# Altium schematic sheet windsensor.SchDoc
size A
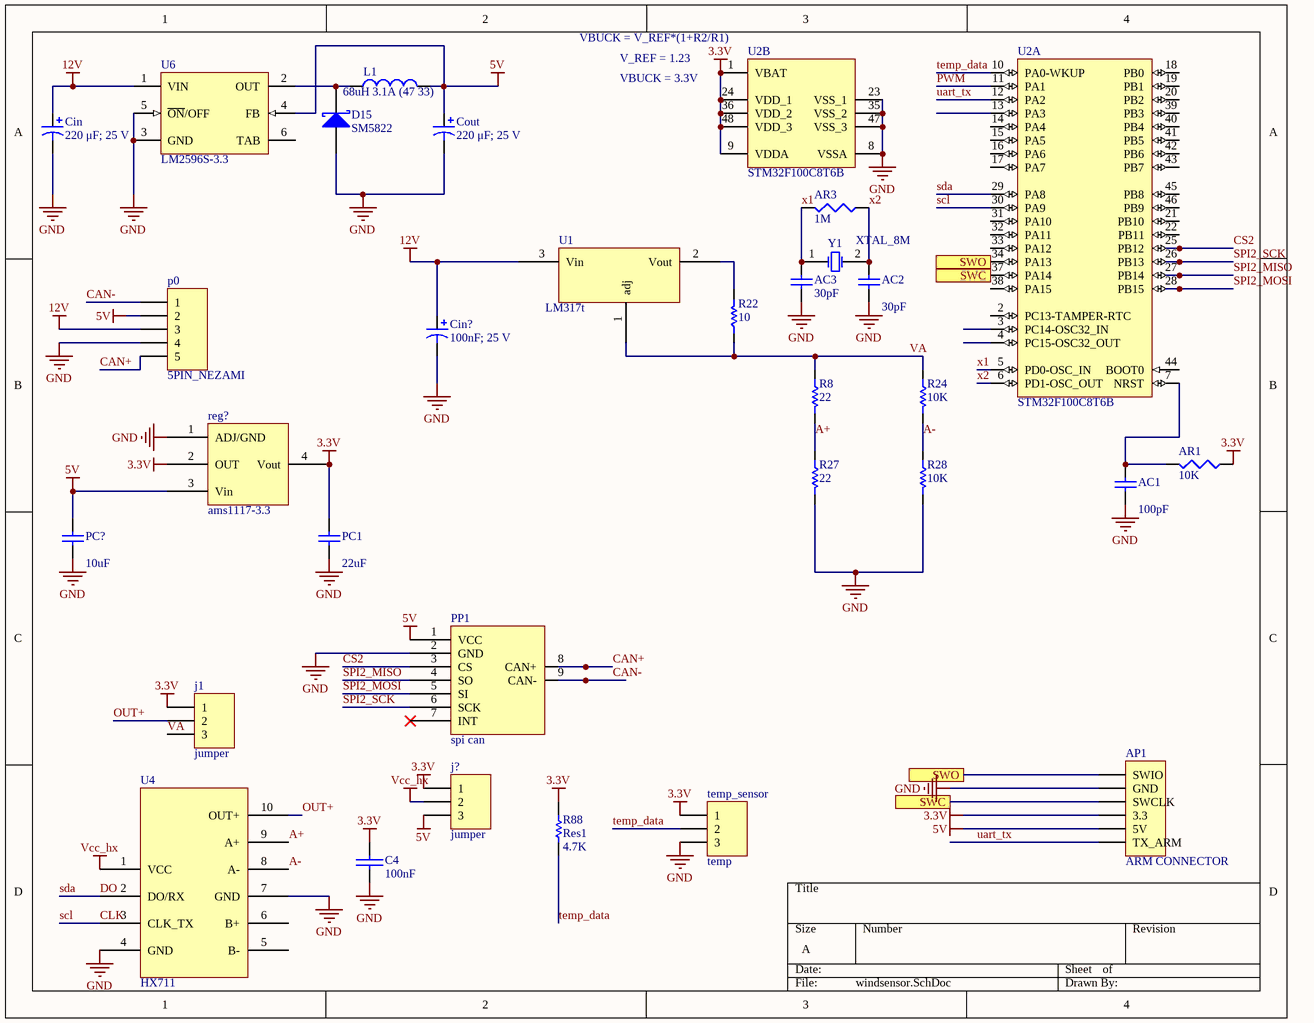
[diagram p0: windsensor.SchDoc]

## Parts
AC1  value 100pF  [1608[0603]]  (hidden comment: Cap Semi)
AC2  value 30pF  [C1206]  (hidden comment: Cap Semi)
AC3  value 30pF  [C1206]  (hidden comment: Cap Semi)
AP1  ARM CONNECTOR  [HDR1X6]
AR1  value 10K  [J1-0603]  (hidden comment: Res3)
AR3  value 1M  [14-1210]  (hidden comment: Res3)
C4  100nF  [C1206]
Cin  220 μF; 25 V  [E]
Cin?  100nF; 25 V  [C1206]
Cout  220 μF; 25 V  [E]
D15  SM5822  [SMB]
j1  jumper  [HDR1X3]
j?  jumper  [HDR1X3]
L1  68uH 3.1A (47 33)  [CAPR5-4X5]
p0  5PIN_NEZAMI  [5PIN_NEZAMI_CAN]
PC1  value 22uF  [C1206]  (hidden comment: Cap Semi)
PC?  value 10uF  [C1206]  (hidden comment: PC1)
PP1  spi can  [SPI_CAN]
R8  22  [1206]
R22  10  [1206]
R24  10K  [1206]
R27  22  [1206]
R28  10K  [1206]
R88  Res1  value 4.7K  [1206]
reg?  ams1117-3.3  [ams]
temp_sensor  temp  [HDR1X3]
U1  LM317t  [LM317T]
U2  STM32F100C8T6B  [STM-LQFP48_N]  (parts A,B of 2)
U4  HX711  [HX711_BREAKOUT_GREEN]
U6  LM2596S-3.3  [TS5B_N]
Y1  XTAL_8M  [RAD-0.2]

## Ports
SWC, SWO

## Nets
3.3V: AP1.4(3.3) AR1.1 C4.1(+) j1.1 j?.1 PC1.1 R88.1 reg?.2(OUT) reg?.4(Vout) temp_sensor.1 U2.1(VBAT) U2.9(VDDA) U2.24(VDD_1) U2.36(VDD_2) U2.48(VDD_3)
5V: AP1.5(5V) Cout.1 j?.3 L1.2 p0.2 PC?.1 PP1.1(VCC) reg?.3(Vin) U6.4(FB)
12V: Cin.1 Cin?.1 p0.3 U1.3(Vin) U6.1(VIN)
GND: AC1.2 AC2.2 AC3.2 AP1.2(GND) C4.2(-) Cin.2 Cin?.2 Cout.2 D15.1(A) p0.4 PC1.2 PC?.2 PP1.2(GND) R27.2 R28.2 reg?.1(ADJ/GND) temp_sensor.3 U2.8(VSSA) U2.23(VSS_1) U2.35(VSS_2) U2.47(VSS_3) U4.4(GND) U4.7(GND) U6.3(GND) U6.5(~{ON}/OFF)
Vcc_hx: j?.2 U4.1(VCC)
A+: R8.2 R27.1 U4.9(A+)
A-: R24.2 R28.1 U4.8(A-)
CAN+: p0.5 PP1.8(CAN+)
CAN-: p0.1 PP1.9(CAN-)
CLK: U2.30(PA9) U4.3(CLK_TX)  [also labelled scl]
CS2: PP1.3(CS) U2.25(PB12)
DO: U2.29(PA8) U4.2(DO/RX)  [also labelled sda]
OUT+: j1.2 U4.10(OUT+)
PWM: U2.11(PA1)
SPI2_MISO: PP1.4(SO) U2.27(PB14)
SPI2_MOSI: PP1.5(SI) U2.28(PB15)
SPI2_SCK: PP1.6(SCK) U2.26(PB13)
SWC: AP1.3(SWCLK) U2.37(PA14) ; port SWC
SWO: AP1.1(SWIO) U2.34(PA13) ; port SWO
temp_data: R88.2 temp_sensor.2 U2.10(PA0-WKUP)
uart_tx: AP1.6(TX_ARM) U2.12(PA2)
VA: j1.3 R8.1 R22.1 R24.1 U1.1(adj)
x1: AC3.1 AR3.2 U2.5(PD0-OSC_IN) Y1.1(OSC1)
x2: AC2.1 AR3.1 U2.6(PD1-OSC_OUT) Y1.2(OSC2)
NetAC1_1: AC1.1 AR1.2 U2.7(NRST)
NetD15_2: D15.2(K) L1.1 U6.2(OUT)
NetR22_2: R22.2 U1.2(Vout)

Not connected (* = marked no-connect by the designer): PP1 7(INT)*; U2 2(PC13-TAMPER-RTC) 3(PC14-OSC32_IN) 4(PC15-OSC32_OUT) 13(PA3) 14(PA4) 15(PA5) 16(PA6) 17(PA7) 18(PB0) 19(PB1) 20(PB2) 21(PB10) 22(PB11) 31(PA10) 32(PA11) 33(PA12) 38(PA15) 39(PB3) 40(PB4) 41(PB5) 42(PB6) 43(PB7) 44(BOOT0) 45(PB8) 46(PB9); U4 5(B-) 6(B+); U6 6(TAB)

## Notes on the sheet
- (near U2) VBUCK = V_REF*(1+R2/R1)
- VBUCK = 3.3V
- V_REF = 1.23

## Library data of the parts
AC1-AC3 PC1 PC? = Cap Semi: Capacitor (Semiconductor SIM Model); Published: 8-Jun-2000; LatestRevisionDate: 29-May-2009; LatestRevisionNote: IPC-7351 Footprint Added.; PackageReference: C1206; Publisher: Altium Limited; PackageDescription: Chip Capacitor
AP1 = Header 6: Header, 6-Pin; LatestRevisionDate: 17-Jul-2002; LatestRevisionNote: Re-released for DXP Platform.; Publisher: Altium Limited
AR1 AR3 = Res3: Resistor; Published: 8-Jun-2000; LatestRevisionDate: 29-May-2009; LatestRevisionNote: IPC-7351 Footprint Added.; PackageReference: J1-0603; Publisher: Altium Limited; PackageDescription: Chip Resistor
C4 = Cap-Bipolar: Bipolar Capacitor; Voltage: 100V; Designer: Saeid Jorablo; Organazation: ControTec; Adding Date: 1387/12/20; Value: 100nF
Cin Cin? Cout = 94SH107X0016EBP: Solid Aluminum Capacitor with Organic Semiconductor Electrolyte: 100uF, 16V, Bulk Pack; Note: Part Numbers shown are for ± 20% capacitance tolerance (X0).; PCB_Layout: Complies with Manufacturer's Recommendation.; DrillSize: Nominal, Rounded to the nearest 0.1mm; Published: 19-Mar-2004; DatasheetDocument: 23-May-2001; PackageReference: E; Publisher: Altium Limited; ComponentLink1Description: Manufacturer Link; ComponentLink1URL: http://www.vishay.com/; ComponentLink2Description: Datasheet; ComponentLink2URL: http://www.vishay.com/docs/90006/94sh.pdf; Value: 100uF
D15 = D Schottky: Schottky Diode; Published: 8-Jun-2000; LatestRevisionDate: 17-Jul-2002; LatestRevisionNote: Re-released for DXP Platform.; PackageReference: SMB; Publisher: Altium Limited; PackageDescription: DO-214-AA/SMB; 2 C-Bend Leads; Body 5.3 x 3.6 mm, inc. leads (LxW); Code_JEDEC: DO-214-AA
j1 j? temp_sensor = Header 3: Header, 3-Pin; LatestRevisionDate: 17-Jul-2002; LatestRevisionNote: Re-released for DXP Platform.; Publisher: Altium Limited
L1 = Inductor: Code_IEC: 1005; Value: 10mH; Published: 8-Jun-2000; LatestRevisionDate: 29-May-2009; LatestRevisionNote: IPC-7351 Footprint Added.; PackageReference: 0402-A; Publisher: Altium Limited; PackageDescription: Chip Inductor; Code_JEITA: 0402
p0 = 5PIN_NEZAMI: Header, 8-Pin; LatestRevisionDate: 17-Jul-2002; LatestRevisionNote: Re-released for DXP Platform.; Publisher: Altium Limited
PP1 = spi module
R8 R22 R24 R27 R28 = Resistor
  R8 R27: Value: 22
  R22: Value: 10
  R24 R28: Value: 10K
R88 = Res1: Resistor; Published: 8-Jun-2000; LatestRevisionDate: 17-Jul-2002; LatestRevisionNote: Re-released for DXP Platform.; PackageReference: AXIAL-0.3; Publisher: Altium Limited; PackageDescription: Axial Device, Thru-Hole; 2 Leads; 0.3 in Pin Spacing
U2 = STM32F100C8T6B: ARM Cortex-M3 32-bit MCU, 64 KB Flash, 8 KB Internal RAM, 37 I/Os, 48-pin LQFP, -40 to 85 degC, Tray; A/D Converter: 1x12-bit (10 Channel); D/A Converter: 2x12-bit (2 Channel); FLASH Size (Prog) (kB): 64; I/Os (High Current): 37; Internal RAM Size (kB): 8; Operating Frequency(F) (Processor speed) (MHz): 24; Supply Voltage(Vcc) min (V): 2; DatasheetVersion: Rev. 7; PackageVersion: Rev. 6, 06/2013; PackageReference: LQFP48; PackageDescription: 48-Pin Low Profile Quad Flat Package, 7 x 7 mm Body, 0.5 mm Pitch; Supplier 1: Digi-Key; Supplier Part Number 1: 497-10499-ND; Supplier 2: Farnell; Supplier Part Number 2: 1838511; Supplier 3: Newark; Supplier Part Number 3: 76R0988; Supplier 4: Mouser; Supplier Part Number 4: 511-STM32F100C8T6B; Core: ARM Cortex-M3; Packing: Tray; Mounting Technology: Surface Mount; PartNumber: STM32F100C8T6B; ComponentLink1Description: Manufacturer URL; ComponentLink1URL: http://www.st.com/web/en/home.html; ComponentLink2Description: Datasheet; ComponentLink2URL: http://www.st.com/st-web-ui/static/active/en/resource/technical/document/datasheet/CD00251732.pdf; ComponentLink3Description: Package Specification; ComponentLink3URL: http://www.st.com/st-web-ui/static/active/en/resource/technical/document/datasheet/DM00058181.pdf
U4 = HX711_BreakoutBoard: Breakout_Board
U6 = LM2596S-ADJ: SIMPLE SWITCHER® Power Converter 150 KHz 3A Step-Down Voltage Regulator, 5-pin TO-263; Manufacturer: National Semiconductor; PackageTopMarking: NSUZXYTTE#*LM2596S*-ADJ P+; PowerWise: N; Published: 4-Dec-2008; DatasheetVersion: May-2002; PackageVersion: revD, Apr-2005; PackageReference: TS5B; Publisher: Altium Limited; PackageDescription: TO-263, Molded, .400 x .390 x .180in, 5 Lead, .067in Pitch, Surface Mount; Supplier 1: Farnell; Supplier Part Number 1: 1523864; Supplier 2: Farnell; Supplier Part Number 2: 9494367; PartNumber: LM2596S-ADJ; RoHS: N; PinCount: 5; CompType: Switcher; Code_JEDEC: MO-169-AB; ComponentLink1Description: LM2596 Datasheet; ComponentLink1URL: http://www.national.com/ds/LM/LM2596.pdf; ComponentLink2Description: LM2596 Web Page; ComponentLink2URL: http://www.national.com/pf/LM/LM2596.html; ComponentLink3Description: TS5B Package Page; ComponentLink3URL: http://www.national.com/packaging/folders/ts5b.html
Y1 = XTAL: Crystal Oscillator; Published: 8-Jun-2000; LatestRevisionDate: 17-Jul-2002; LatestRevisionNote: Re-released for DXP Platform.; PackageReference: R38; Publisher: Altium Limited; PackageDescription: Crystal, Thru-Hole; 2 Leads; Body 3.1 x 8.2 mm (Dia.xH)